# EAGLE design NodeMCU_i2c_1wire_Breakout (EAGLE 8.2.1)
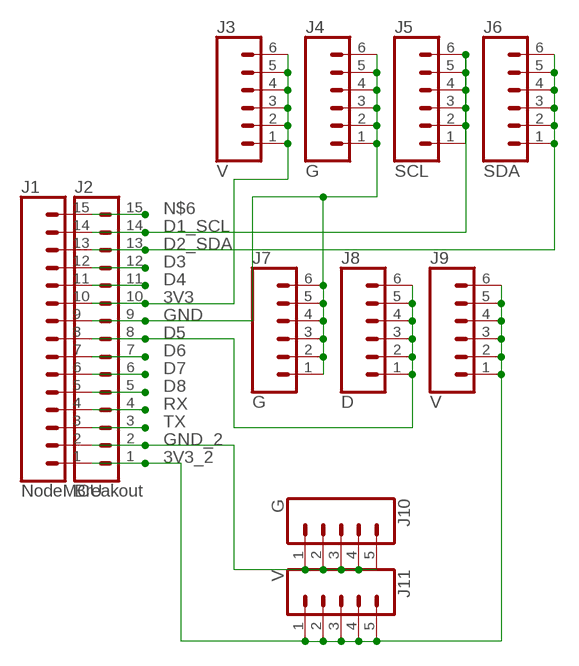
[diagram p0: schematic, sheet 1]

## Parts
J1  NodeMCU  CONN_15  [1X15]
J2  Breakout  CONN_15  [1X15]
J3  V  CONN_06SILK_FEMALE_PTH  [1X06]
J4  G  CONN_06SILK_FEMALE_PTH  [1X06]
J5  SCL  CONN_06SILK_FEMALE_PTH  [1X06]
J6  SDA  CONN_06SILK_FEMALE_PTH  [1X06]
J7  G  CONN_06SILK_FEMALE_PTH  [1X06]
J8  D  CONN_06SILK_FEMALE_PTH  [1X06]
J9  V  CONN_06SILK_FEMALE_PTH  [1X06]
J10  G  CONN_05  [1X05]
J11  V  CONN_05  [1X05]

## Nets
3V3: J1.10 J2.10 J3.1 J3.2 J3.3 J3.4 J3.5 J3.6
3V3_2: J1.1 J2.1 J9.1 J9.2 J9.3 J9.4 J9.5 J9.6 J11.1 J11.2 J11.3 J11.4 J11.5
D1_SCL: J1.14 J2.14 J5.1 J5.2 J5.3 J5.4 J5.5 J5.6
D2_SDA: J1.13 J2.13 J6.1 J6.2 J6.3 J6.4 J6.5 J6.6
D3: J1.12 J2.12
D4: J1.11 J2.11
D5: J1.8 J2.8 J8.1 J8.2 J8.3 J8.4 J8.5 J8.6
D6: J1.7 J2.7
D7: J1.6 J2.6
D8: J1.5 J2.5
GND: J1.9 J2.9 J4.1 J4.2 J4.3 J4.4 J4.5 J4.6 J7.1 J7.2 J7.3 J7.4 J7.5 J7.6
GND_2: J1.2 J2.2 J10.1 J10.2 J10.3 J10.4 J10.5
N$6: J1.15 J2.15
RX: J1.4 J2.4
TX: J1.3 J2.3

## Library data of the parts
J1 J2 = SparkFun-Connectors:CONN_15: Multi connection point. Often used as Generic Header-pin footprint for 0.1 inch spaced/style header connections On any of the 0.1 inch spaced packages, you can populate with these: Break Away Headers - Straight <https://www.sparkfun.com/products/116> (PRT-00116) Break Away Male Headers - Right Angle <https://www.sparkfun.com/products/553> (PRT-00553) Female Headers <https://www.sparkfun.com/products/115> (PRT-00115) Break Away Headers - Machine Pin <https://www.sparkfun.com/products/117> (PRT-00117) Break Away Female Headers - Swiss Machine Pin <https://www.sparkfun.com/products/743> (PRT-00743) For SCREWTERMINALS and SPRING TERMINALS visit here: Screw Terimnals on SparkFun.com <https://www.sparkfun.com/search/results?term=Screw+Terminals> (5mm/3.5mm/2.54mm spacing) This device is also useful as a general connection point to wire up your design to another part of your project. Our various solder wires solder well into these plated through hole pads. Hook-Up Wire - Assortment (Stranded, 22 AWG) <https://www.sparkfun.com/products/11375> (PRT-11375) Hook-Up Wire - Assortment (Solid Core, 22 AWG) <https://www.sparkfun.com/products/11367> (PRT-11367) View the entire wire category on our website here <https://www.sparkfun.com/categories/141> Special notes: Molex polarized connector foot print use with SKU : PRT-08231 with associated crimp pins and housings. 1MM SMD Version SKU: PRT-10208 NOTES ON THE VARIANTS LOCK and LOCK_LONGPADS... This footprint was designed to help hold the alignment of a through-hole component (i.e. 6-pin header) while soldering it into place. You may notice that each hole has been shifted either up or down by 0.005 of an inch from it's more standard position (which is a perfectly straight line). This slight alteration caused the pins (the squares in the middle) to touch the edges of the holes. Because they are alternating, it causes a "brace" to hold the component in place. 0.005 has proven to be the perfect amount of "off-center" position when using our standard breakaway headers. Although looks a little odd when you look at the bare footprint, once you have a header in there, the alteration is very hard to notice. Also,if you push a header all the way into place, it is covered up entirely on the bottom side.
J3-J9 = SparkFun-Connectors:CONN_06: Multi connection point. Often used as Generic Header-pin footprint for 0.1 inch spaced/style header connections On any of the 0.1 inch spaced packages, you can populate with these: Break Away Headers - Straight <https://www.sparkfun.com/products/116> (PRT-00116) Break Away Male Headers - Right Angle <https://www.sparkfun.com/products/553> (PRT-00553) Female Headers <https://www.sparkfun.com/products/115> (PRT-00115) Break Away Headers - Machine Pin <https://www.sparkfun.com/products/117> (PRT-00117) Break Away Female Headers - Swiss Machine Pin <https://www.sparkfun.com/products/743> (PRT-00743) Arduino Stackable Header - 6 Pin <https://www.sparkfun.com/products/9280> (PRT-09280) For SCREWTERMINALS and SPRING TERMINALS visit here: Screw Terimnals on SparkFun.com <https://www.sparkfun.com/search/results?term=Screw+Terminals> (5mm/3.5mm/2.54mm spacing) This device is also useful as a general connection point to wire up your design to another part of your project. Our various solder wires solder well into these plated through hole pads. Hook-Up Wire - Assortment (Stranded, 22 AWG) <https://www.sparkfun.com/products/11375> (PRT-11375) Hook-Up Wire - Assortment (Solid Core, 22 AWG) <https://www.sparkfun.com/products/11367> (PRT-11367) View the entire wire category on our website here <https://www.sparkfun.com/categories/141>; PROD_ID: CONN-08437
J10 J11 = SparkFun-Connectors:CONN_05: Multi connection point. Often used as Generic Header-pin footprint for 0.1 inch spaced/style header connections On any of the 0.1 inch spaced packages, you can populate with these: Break Away Headers - Straight <https://www.sparkfun.com/products/116> (PRT-00116) Break Away Male Headers - Right Angle <https://www.sparkfun.com/products/553> (PRT-00553) Female Headers <https://www.sparkfun.com/products/115> (PRT-00115) Break Away Headers - Machine Pin <https://www.sparkfun.com/products/117> (PRT-00117) Break Away Female Headers - Swiss Machine Pin <https://www.sparkfun.com/products/743> (PRT-00743) For SCREWTERMINALS and SPRING TERMINALS visit here: Screw Terimnals on SparkFun.com <https://www.sparkfun.com/search/results?term=Screw+Terminals> (5mm/3.5mm/2.54mm spacing) This device is also useful as a general connection point to wire up your design to another part of your project. Our various solder wires solder well into these plated through hole pads. Hook-Up Wire - Assortment (Stranded, 22 AWG) <https://www.sparkfun.com/products/11375> (PRT-11375) Hook-Up Wire - Assortment (Solid Core, 22 AWG) <https://www.sparkfun.com/products/11367> (PRT-11367) View the entire wire category on our website here <https://www.sparkfun.com/categories/141> Special notes: Molex polarized connector foot print use with SKU : PRT-08231 with associated crimp pins and housings. 1MM SMD Version SKU: PRT-10208

## Board
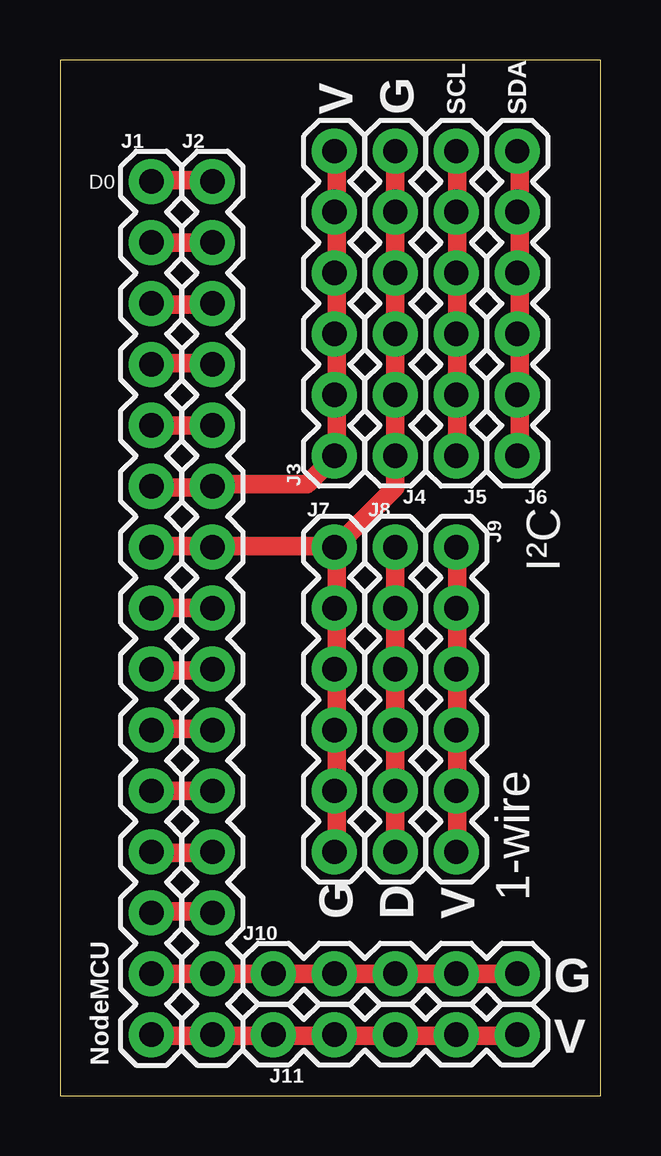
[diagram p1: board, top side]
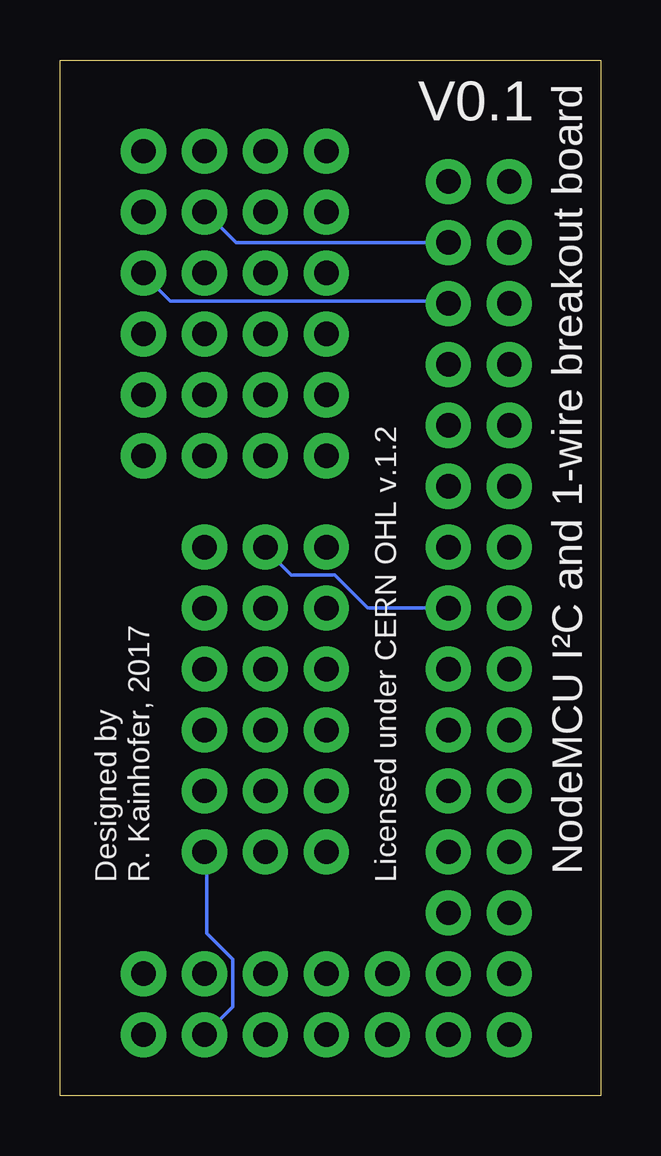
[diagram p2: board, bottom side, seen from below]

Size 22.53 x 43.17 mm. Coordinates in mm from the lower left corner, seen from the top.
Outline: 0,0 22.53,0 22.53,43.17 0,43.17 0,0
Copper layers (1*16): Top 0.0356mm / dielectric 1.5011mm / Bottom 0.0356mm
Design rules "PCBs_io": minimum track width 6mil, minimum drill 13mil, track to track 6mil, track to pad 6mil, pad to pad 6mil, via to via 6mil, smd to smd 6mil, copper to edge 15mil, drill to drill 6mil, minimum pad ring 7mil, minimum via ring 7mil, stop-mask expansion 3mil, vias tented up to drill 0mil, thermal gap 10mil

### Footprints (pad centres in the part's own frame; a part is rotated, then mirrored left to right if it is on the bottom)
1X15 = drill 1.016 pad 1.88: 1 0,0; 2 2.54,0; 3 5.08,0; 4 7.62,0; 5 10.16,0; 6 12.7,0; 7 15.24,0; 8 17.78,0; 9 20.32,0; 10 22.86,0; 11 25.4,0; 12 27.94,0; 13 30.48,0; 14 33.02,0; 15 35.56,0
1X06 = drill 1.016 pad 1.88: 1 0,0; 2 2.54,0; 3 5.08,0; 4 7.62,0; 5 10.16,0; 6 12.7,0
1X05 = drill 1.016 pad 1.88: 1 0,0; 2 2.54,0; 3 5.08,0; 4 7.62,0; 5 10.16,0

### Placement (x,y rotation side)
J1  3.81,2.54 90 top
J2  6.35,2.54 90 top
J3  11.43,39.37 270 top
J4  13.97,39.37 270 top
J5  16.51,39.37 270 top
J6  19.05,39.37 270 top
J7  11.43,22.86 270 top
J8  13.97,22.86 270 top
J9  16.51,22.86 270 top
J10  8.89,5.08 0 top
J11  8.89,2.54 0 top

### Tracks (layer width: path | path; a pad name or v marks a point on that pad's centre or on a via)
3V3
  Top 0.762: 11.53,36.83 11.53,34.39 J3.3 11.53,34.24 11.53,31.8 J3.4 11.53,31.65 11.53,29.21 | 11.53,36.83 11.53,39.27 J3.1 | 11.53,36.83 J3.2 | 11.53,29.21 11.53,26.77 J3.6 11.38,26.57 10.31,25.5 6.35,25.5 J2.10 6.35,25.35 3.91,25.35 J1.10 | 11.53,29.21 J3.5
3V3_2
  Top 0.762: J11.5 19,2.49 16.56,2.49 J11.4 16.41,2.49 13.97,2.49 | 6.35,2.49 3.91,2.49 J1.1 | 6.35,2.49 8.79,2.49 J11.1 8.94,2.49 11.38,2.49 J11.2 11.53,2.49 13.97,2.49 | 6.35,2.49 J2.1 | 13.97,2.49 J11.3 | J9.6 16.56,10.16 16.56,12.6 J9.5 16.56,12.75 16.56,15.19 J9.4 16.56,15.34 16.56,17.78 | 16.56,17.78 16.56,20.22 J9.2 16.56,20.37 16.56,22.81 J9.1 | 16.56,17.78 J9.3
  Bottom 0.152: 16.41,10.16 J9.6 16.41,10.11 16.41,6.76 15.34,5.69 15.34,3.71 J11.4
D1_SCL
  Top 0.762: 16.56,29.21 16.56,26.77 J5.6 | 16.56,29.21 16.56,31.65 J5.4 16.56,31.8 16.56,34.24 J5.3 16.56,34.39 16.56,36.83 | 16.56,29.21 J5.5 | 16.56,36.83 16.56,39.27 J5.1 | 16.56,36.83 J5.2 | J2.14 J1.14
  Bottom 0.152: J2.14 15.19,35.56 16.41,36.78 J5.2
D2_SDA
  Top 0.762: 19.15,29.21 19.15,26.77 J6.6 | 19.15,29.21 19.15,31.65 J6.4 19.15,31.8 19.15,34.24 J6.3 19.15,34.34 19.15,36.78 J6.2 19.15,36.83 19.15,39.27 J6.1 | 19.15,29.21 J6.5 | J1.13 3.91,32.97 6.35,32.97 J2.13
  Bottom 0.152: J2.13 6.35,33.12 17.93,33.12 19,34.19 J6.3
D3
  Top 0.762: J1.12 3.91,30.53 6.35,30.53 J2.12
D4
  Top 0.762: J2.11 J1.11
D5
  Top 0.762: J8.6 J8.5 J8.4 J8.3 J8.2 J8.1 | J2.8 J1.8
  Bottom 0.152: 13.97,22.81 J8.1 13.97,22.76 12.9,21.69 11.07,21.69 9.7,20.32 J2.8
D6
  Top 0.762: J1.7 3.91,17.73 6.35,17.73 J2.7
D7
  Top 0.762: J1.6 3.91,15.29 6.35,15.29 J2.6
D8
  Top 0.762: J2.5 J1.5
GND
  Top 0.762: 6.35,22.91 3.91,22.91 J1.9 | J7.6 11.53,10.16 11.53,12.6 J7.5 11.53,12.75 11.53,15.19 J7.4 11.53,15.34 11.53,17.78 | 11.53,17.78 11.53,20.22 J7.2 11.53,20.37 11.53,22.81 J7.1 | 11.53,17.78 J7.3 | J4.1 J4.2 J4.3 J4.4 J4.5 J4.6 13.97,25.35 11.53,22.91 J7.1 | 6.35,22.91 11.38,22.91 J7.1 | 6.35,22.91 J2.9
GND_2
  Top 0.762: J10.5 J10.4 J10.3 J10.2 J10.1 J2.2 J1.2
N$6
  Top 0.762: J1.15 3.91,38.15 6.35,38.15 J2.15
RX
  Top 0.762: J1.4 3.91,10.11 6.35,10.11 J2.4
TX
  Top 0.762: J1.3 3.91,7.67 6.35,7.67 J2.3

### Text on the board
tNames: D0 | I²C | 1-wire
bNames: NodeMCU I²C and 1-wire breakout board | V0.1 | Licensed under CERN OHL v.1.2 | Designed by / R. Kainhofer, 2017